# EAGLE design stm32_pi_board (EAGLE 7.4.0)
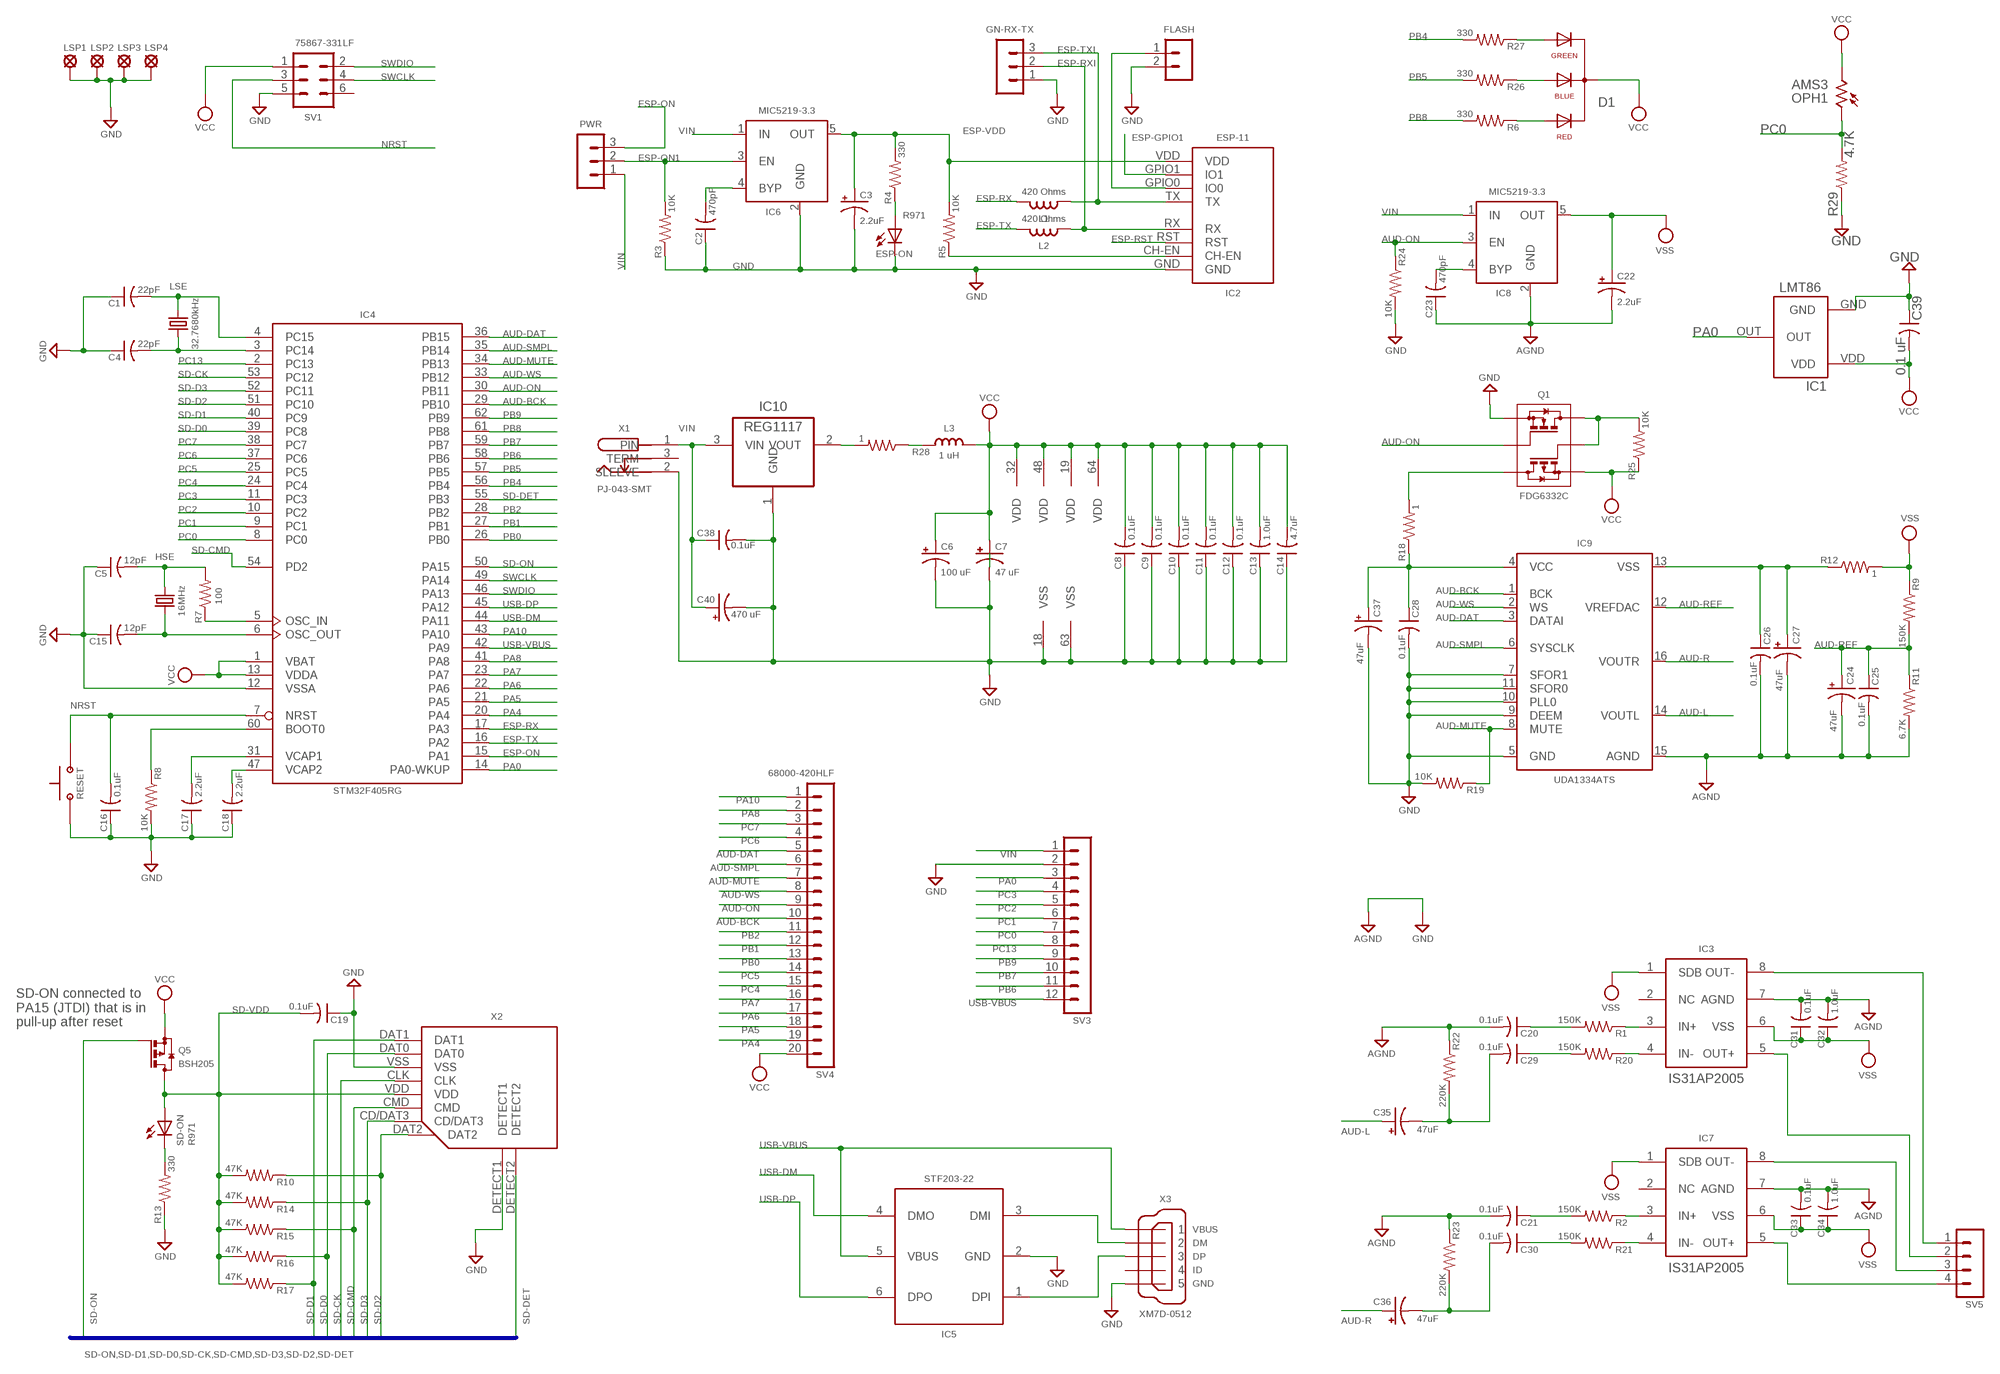
[diagram p0: schematic, sheet 1]

## Parts
C1  22pF  C-US0805  [C0805]
C2  470pF  C-US0805  [C0805]
C3  2.2uF  CPOL-US0805  [CPOL0805]
C4  22pF  C-US0805  [C0805]
C5  12pF  C-US0805  [C0805]
C6  100 uF  CPOL-US1311  [CPOL1311]
C7  47 uF  CPOL-US0805  [CPOL0805]
C8  0.1uF  C-US0805  [C0805]
C9  0.1uF  C-US0805  [C0805]
C10  0.1uF  C-US0805  [C0805]
C11  0.1uF  C-US0805  [C0805]
C12  0.1uF  C-US0805  [C0805]
C13  1.0uF  C-US0805  [C0805]
C14  4.7uF  C-US0805  [C0805]
C15  12pF  C-US0805  [C0805]
C16  0.1uF  C-US0805  [C0805]
C17  2.2uF  C-US0805  [C0805]
C18  2.2uF  C-US0805  [C0805]
C19  0.1uF  C-US0805  [C0805]
C20  0.1uF  C-US0805  [C0805]
C21  0.1uF  C-US0805  [C0805]
C22  2.2uF  CPOL-US0805  [CPOL0805]
C23  470pF  C-US0805  [C0805]
C24  47uF  CPOL-US1311  [CPOL1311]
C25  0.1uF  C-US0805  [C0805]
C26  0.1uF  C-US0805  [C0805]
C27  47uF  CPOL-US1311  [CPOL1311]
C28  0.1uF  C-US0805  [C0805]
C29  0.1uF  C-US0805  [C0805]
C30  0.1uF  C-US0805  [C0805]
C31  0.1uF  C-US0805  [C0805]
C32  1.0uF  C-US0805  [C0805]
C33  0.1uF  C-US0805  [C0805]
C34  1.0uF  C-US0805  [C0805]
C35  47uF  CPOL-US1311  [CPOL1311]
C36  47uF  CPOL-US1311  [CPOL1311]
C37  47uF  CPOL-US1311  [CPOL1311]
C38  0.1uF  C-US0805  [C0805]
C39  0.1 uF  C-US0805  [C0805]
C40  470 uF  CPOL-US2917  [CPOL2917]
D1  RGB-LED3X1MM  [RGB-LED-SMD-3X1]
ESP-ON  R971  LEDCHIP-LED0805  [CHIP-LED0805]
FLASH  MA02-1  [MA02-1]
GN-RX-TX  MA03-1PL  [MA03-1]
HSE  16MHz  Q-HSEHC-46X  [Q-HC-46X]
IC1  LMT86  [LMT86]
IC2  ESP-11  [ESP-11]
IC3  IS31AP2005  [MSOP-8]
IC4  STM32F405RG  STM32F405RGT  [LQFP64]
IC5  STF203-22  [SC70-6]
IC6  MIC5219-3.3  MIC5219XX  [SOT23-5]
IC7  IS31AP2005  [MSOP-8]
IC8  MIC5219-3.3  MIC5219XX  [SOT23-5]
IC9  UDA1334ATS  [SSOP16]
IC10  REG1117  [SOT223]
L1  420 Ohms  L-USL0603  [L0603]
L2  420 Ohms  L-USL0603  [L0603]
L3  1 uH  L-USL0805  [L0805]
LSE  32.7680kHz  Q-LSECM7V-T1A  [Q-CM7V-T1A]
LSP1  LSP27  [LSP27]
LSP2  LSP27  [LSP27]
LSP3  LSP27  [LSP27]
LSP4  LSP27  [LSP27]
OPH1  AMS3  VT935GB  [VT900]
PWR  MA03-1PL  [MA03-1]
Q1  FDG6332C  N-P-MOS  [SC70-6]
Q5  BSH205  BSH205G2R  [SOT23]
R1  150K  R-US0805  [R0805]
R2  150K  R-US0805  [R0805]
R3  10K  R-US0805  [R0805]
R4  330  R-US0805  [R0805]
R5  10K  R-US0805  [R0805]
R6  330  R-US0805  [R0805]
R7  100  R-US0805  [R0805]
R8  10K  R-US0805  [R0805]
R9  150K  R-US0805  [R0805]
R10  47K  R-US0805  [R0805]
R11  6.7K  R-US0805  [R0805]
R12  1  R-US0805  [R0805]
R13  330  R-US0805  [R0805]
R14  47K  R-US0805  [R0805]
R15  47K  R-US0805  [R0805]
R16  47K  R-US0805  [R0805]
R17  47K  R-US0805  [R0805]
R18  1  R-US0805  [R0805]
R19  10K  R-US0805  [R0805]
R20  150K  R-US0805  [R0805]
R21  150K  R-US0805  [R0805]
R22  220K  R-US0805  [R0805]
R23  220K  R-US0805  [R0805]
R24  10K  R-US0805  [R0805]
R25  10K  R-US0805  [R0805]
R26  330  R-US0805  [R0805]
R27  330  R-US0805  [R0805]
R28  1  R-US0805  [R0805]
R29  4.7K  R-US0805  [R0805]
RESET  BUTTON-FSM14JRT  [BUTTON-FSM14JRT]
SD-ON  R971  LEDCHIP-LED0805  [CHIP-LED0805]
SV1  75867-331LF  MA03-2  [MA03-2]
SV3  MA12-1NO-PL  [MA12-1-NO-PL]
SV4  68000-420HLF  MA20-1NO-PL  [MA20-1-NO-PL]
SV5  MA04-1PL  [MA04-1]
X1  PJ-043-SMT  DC-POWER-JACK2  [BUCHSE-1.0X3.2]
X2  DM3AT  MICRO-SD-DM3AT  [DM3AT]
X3  XM7D-0512  MINI-USB-5-DPI  [XM7D-0512]

## Nets
AUD-BCK: IC4.29(PB10) IC9.1(BCK) SV4.10
AUD-DAT: IC4.36(PB15) IC9.3(DATAI) SV4.5
AUD-L: C35.1+(+) IC9.14(VOUTL)
AUD-MUTE: IC4.34(PB13) IC9.8(MUTE) R19.1 SV4.7
AUD-ON: IC4.30(PB11) IC8.3(EN) Q1.2 R24.1 SV4.9
AUD-R: C36.1+(+) IC9.16(VOUTR)
AUD-REF: C24.1+(+) C25.1 IC9.12(VREFDAC) R9.2 R11.1
AUD-SMPL: IC4.35(PB14) IC9.6(SYSCLK) SV4.6
AUD-WS: IC4.33(PB12) IC9.2(WS) SV4.8
BOOT: IC4.60(BOOT0) R8.1
ESP-GPIO1: IC2.GPIO1(IO1)
ESP-IO0: FLASH.1 IC2.GPIO0(IO0)
ESP-ON: IC4.15(PA1) PWR.3
ESP-ON1: IC6.3(EN) PWR.2 R3.2
ESP-RST: IC2.RST
ESP-RX: IC4.17(PA3) L1.2
ESP-RXI: GN-RX-TX.2 IC2.RX L2.1
ESP-TX: IC4.16(PA2) L2.2
ESP-TXI: GN-RX-TX.3 IC2.TX L1.1
ESP-VDD: C3.1+(+) IC2.VDD IC6.5(OUT) R4.2 R5.2
GND: C1.1 C2.1 C3.2-(-) C4.1 C5.1 C6.2-(-) C7.2-(-) C8.1 C9.1 C10.1 C11.1 C12.1 C13.1 C14.1 C15.1 C16.1 C17.1 C18.1 C19.1 C20.2 C21.2 C22.2-(-) C23.1 C24.2-(-) C25.2 C26.2 C27.2-(-) C28.2 C31.2 C32.2 C33.2 C34.2 C37.2-(-) C38.2 C39.1 C40.- ESP-ON.C FLASH.2 GN-RX-TX.1 IC1.GND IC2.GND IC3.7(AGND) IC4.12(VSSA) IC4.18(VSS) IC4.63(VSS) IC5.2(GND) IC6.2(GND) IC7.7(AGND) IC8.2(GND) IC9.5(GND) IC9.7(SFOR1) IC9.9(DEEM) IC9.10(PLL0) IC9.11(SFOR0) IC9.15(AGND) IC10.1(GND) LSP1.MP LSP2.MP LSP3.MP LSP4.MP Q1.1 R3.1 R8.2 R11.2 R13.1 R19.2 R22.1 R23.1 R24.2 R29.1 RESET.P$1 SV1.5 SV3.2 X1.2(SLEEVE) X2.DETECT1 X2.VSS X3.5 ; supply symbol labelled AGND
N$4: C2.2 IC6.4(BYP)
N$5: D1.P$1(AR) R6.1
N$6: IC4.5(OSC_IN) R7.1
N$10: ESP-ON.A R4.1
N$11: IC3.8(OUT-) SV5.1
N$13: IC3.5(OUT+) SV5.2
N$17: C20.1 R1.2
N$22: IC7.8(OUT-) SV5.3
N$24: IC7.5(OUT+) SV5.4
N$26: IC3.3(IN+) R1.1
N$27: IC7.3(IN+) R2.1
N$29: IC5.1(DPI) X3.3
N$36: IC5.3(DMI) X3.2
N$37: C21.1 R2.2
N$38: IC3.4(IN-) R20.1
N$40: D1.P$4(AB) R26.1
N$42: C28.1 C37.1+(+) IC9.4(VCC) R18.1
N$43: IC7.4(IN-) R21.1
N$44: C23.2 IC8.4(BYP)
N$46: C26.1 C27.1+(+) IC9.13(VSS) R12.1
N$47: C30.1 R21.2
N$64: IC2.CH-EN R5.1
N$65: C29.1 R20.2
N$69: C29.2 C35.2-(-) R22.2
N$70: Q1.3 R18.2
N$71: C5.2 HSE.1 R7.2
N$72: C30.2 C36.2-(-) R23.2
N$75: D1.P$3(AG) R27.1
N$78: C15.2 HSE.2 IC4.6(OSC_OUT)
N$85: IC10.2(VOUT) R28.2
N$86: Q1.5 Q1.6 R25.2
N$90: L3.1 R28.1
N$120: R13.2 SD-ON.C
NRST: C16.2 IC4.7(NRST) RESET.P$2 SV1.3
PA0: IC1.OUT IC4.14(PA0-WKUP) SV3.3
PA4: IC4.20(PA4) SV4.19
PA5: IC4.21(PA5) SV4.18
PA6: IC4.22(PA6) SV4.17
PA7: IC4.23(PA7) SV4.16
PA8: IC4.41(PA8) SV4.2
PA10: IC4.43(PA10) SV4.1
PB0: IC4.26(PB0) SV4.13
PB1: IC4.27(PB1) SV4.12
PB2: IC4.28(PB2) SV4.11
PB4: IC4.56(PB4) R27.2
PB5: IC4.57(PB5) R26.2
PB6: IC4.58(PB6) SV3.11
PB7: IC4.59(PB7) SV3.10
PB8: IC4.61(PB8) R6.2
PB9: IC4.62(PB9) SV3.9
PC0: IC4.8(PC0) OPH1.1 R29.2 SV3.7
PC1: IC4.9(PC1) SV3.6
PC2: IC4.10(PC2) SV3.5
PC3: IC4.11(PC3) SV3.4
PC4: IC4.24(PC4) SV4.15
PC5: IC4.25(PC5) SV4.14
PC6: IC4.37(PC6) SV4.4
PC7: IC4.38(PC7) SV4.3
PC13: IC4.2(PC13) SV3.8
Q2M: C4.2 IC4.3(PC14) LSE.1
Q2P: C1.2 IC4.4(PC15) LSE.2
SD-CK: IC4.53(PC12) X2.CLK
SD-CMD: IC4.54(PD2) R15.1 X2.CMD
SD-D0: IC4.39(PC8) R16.1 X2.DAT0
SD-D1: IC4.40(PC9) R17.1 X2.DAT1
SD-D2: IC4.51(PC10) R10.1 X2.DAT2
SD-D3: IC4.52(PC11) R14.1 X2.CD/DAT3
SD-DET: IC4.55(PB3) X2.DETECT2
SD-ON: IC4.50(PA15) Q5.1(G)
SD-VDD: C19.2 Q5.3(D) R10.2 R14.2 R15.2 R16.2 R17.2 SD-ON.A X2.VDD
SWCLK: IC4.49(PA14) SV1.4
SWDIO: IC4.46(PA13) SV1.2
USB-DM: IC4.44(PA11) IC5.4(DMO)
USB-DP: IC4.45(PA12) IC5.6(DPO)
USB-VBUS: IC4.42(PA9) IC5.5(VBUS) SV3.12 X3.1
VCAP3: C18.2 IC4.47(VCAP2)
VCAP4: C17.2 IC4.31(VCAP1)
VDD: C6.1+(+) C7.1+(+) C8.2 C9.2 C10.2 C11.2 C12.2 C13.2 C14.2 C39.2 D1.P$2(C) IC1.VDD IC4.1(VBAT) IC4.13(VDDA) IC4.19(VDD) IC4.32(VDD) IC4.48(VDD) IC4.64(VDD) L3.2 OPH1.2 Q1.4 Q5.2(S) R25.1 SV1.1 SV4.20 ; supply symbol labelled VCC
VIN: C38.1 C40.+ IC6.1(IN) IC8.1(IN) IC10.3(VIN) PWR.1 SV3.1 X1.1(PIN)
VSS: C22.1+(+) C31.1 C32.1 C33.1 C34.1 IC3.1(SDB) IC3.6(VSS) IC7.1(SDB) IC7.6(VSS) IC8.5(OUT) R9.1 R12.2
Unconnected: IC3.2(NC) IC7.2(NC) SV1.6 X1.3(TERM) X3.4 X3.M1(S1) X3.M2(S2) X3.M3(S3) X3.M4(S4)

## Buses
SD-ON,SD-D1,SD-D0,SD-CK,SD-CMD,SD-D3,SD-D2,SD-DET

## Notes on the sheet
- SD-ON connected to 
  PA15 (JTDI) that is in 
  pull-up after reset

## Library data of the parts
C1 C2 C4 C5 C8-C21 C23 C25 C26 C28-C34 C38 C39 = MyComponents:C-US: SMD Multilayer Ceramic Capacitor; MOUSER: 80-C0805C104J5RAUTO
C3 C7 C22 = MyComponents:CPOL-US: SMT Tantalum Capacitor; MOUSER: 581-TAJR225K016RNJ
C6 C24 C27 C35-C37 = MyComponents:CPOL-US: SMT Tantalum Capacitor; MOUSER: 581-F951C476KBAAQ2
C40 = MyComponents:CPOL-US: SMT Tantalum Capacitor; MOUSER: 581-TPSE477K010R0200
D1 = MyComponents:RGB-LED: T-1 3/4 (5mm) full color LED lamp; MOUSER: 604-APFA3010LSEEZGKQ
ESP-ON SD-ON = led:LED: LED OSRAM: - CHIPLED LG R971, LG N971, LY N971, LG Q971, LY Q971, LO R971, LY R971 LH N974, LH R974 LS Q976, LO Q976, LY Q976 LO Q996 - Hyper CHIPLED LW Q18S LB Q993, LB Q99A, LB R99A - SideLED LS A670, LO A670, LY A670, LG A670, LP A670 LB A673, LV A673, LT A673, LW A673 LH A674 LY A675 LS A676, LA A676, LO A676, LY A676, LW A676 LS A679, LY A679, LG A679 - Hyper Micro SIDELED® LS Y876, LA Y876, LO Y876, LY Y876 LT Y87S - SmartLED LW L88C, LW L88S LB L89C, LB L89S, LG L890 LS L89K, LO L89K, LY L89K LS L896, LA L896, LO L896, LY L896 - TOPLED LS T670, LO T670, LY T670, LG T670, LP T670 LSG T670, LSP T670, LSY T670, LOP T670, LYG T670 LG T671, LOG T671, LSG T671 LB T673, LV T673, LT T673, LW T673 LH T674 LS T676, LA T676, LO T676, LY T676, LB T676, LH T676, LSB T676, LW T676 LB T67C, LV T67C, LT T67C, LS T67K, LO T67K, LY T67K, LW E67C LS E67B, LA E67B, LO E67B, LY E67B, LB E67C, LV E67C, LT E67C LW T67C LS T679, LY T679, LG T679 LS T770, LO T770, LY T770, LG T770, LP T770 LB T773, LV T773, LT T773, LW T773 LH T774 LS E675, LA E675, LY E675, LS T675 LS T776, LA T776, LO T776, LY T776, LB T776 LHGB T686 LT T68C, LB T68C - Hyper Mini TOPLED® LB M676 - Mini TOPLED Santana® LG M470 LS M47K, LO M47K, LY M47K Source: http://www.osram.convergy.de LUXEON: - LUMILED® LXK2-PW12-R00, LXK2-PW12-S00, LXK2-PW14-U00, LXK2-PW14-V00 LXK2-PM12-R00, LXK2-PM12-S00, LXK2-PM14-U00 LXK2-PE12-Q00, LXK2-PE12-R00, LXK2-PE12-S00, LXK2-PE14-T00, LXK2-PE14-U00 LXK2-PB12-K00, LXK2-PB12-L00, LXK2-PB12-M00, LXK2-PB14-N00, LXK2-PB14-P00, LXK2-PB14-Q00 LXK2-PR12-L00, LXK2-PR12-M00, LXK2-PR14-Q00, LXK2-PR14-R00 LXK2-PD12-Q00, LXK2-PD12-R00, LXK2-PD12-S00 LXK2-PH12-R00, LXK2-PH12-S00 LXK2-PL12-P00, LXK2-PL12-Q00, LXK2-PL12-R00 Source: www.luxeon.com KINGBRIGHT: KA-3528ASYC Source: www.kingbright.com
FLASH = MyComponents:MA02-1: Headers & Wire Housing, 1 Row, 3 Position
GN-RX-TX PWR = MyComponents:MA03-1: Headers & Wire Housing, 1 Row, 3 Position
HSE = MyComponents:Q-HSE: HSE SMD Crystal; MOUSER: 520-160-20-46X
IC1 = MyComponents:LMT86: Analog Temperature Sensors withClass-AB Output; MOUSER: 95-LMT86LP
IC2 = MyComponents:ESP-11: ESP8266 WiFi Module ESP-11
IC3 IC7 = MyComponents:IS31AP2005: Class-D mono audio power amplifier (2.95W); MOUSER: 870-31AP2005SLS2TR
IC4 = stm32:STM32F405R*T: ARM 32-bit Cortex™-M3 CPU 168 MHz maximum frequency 1024 Kbytes of Flash memory 192 kbytes of SRAM 51 GPIOs 1.8 to 3.6 V application supply; MOUSER: 511-STM32F405RGT6
IC5 = MyComponents:STF203: USB EMI filtering and ESD protection; MOUSER: 947-STF203-22.TCT
IC6 IC8 = MyComponents:MIC5219XX: 500mA-Peak Output LDO Regulator; MOUSER: 998-MIC5219-3.3YM5TR
IC9 = MyComponents:UDA1334ATS: Low power audio DAC with PLL; MOUSER: 771-UDA1334ATSDH-T
IC10 = MyComponents:REG1117: 800mA and 1A Low Dropout (LDO) Positive Regulator 1.8V, 2.5V, 2.85V, 3.3V, 5V, and Adj; MOUSER: 511-LD1117S33
L1 L2 = MyComponents:L-US: SMD Ferrite Bead; MOUSER: 81-BLM11B421S
L3 = MyComponents:L-US: SMD Ferrite Bead; MOUSER: 963-CKP2012N1R0M-T
LSE = MyComponents:Q-LSE: 32.768 kHz SMD Crystal; MOUSER: 428-201562-MG01
LSP1-LSP4 = MyComponents:LSP27: Solder Pad, drill 2.75 mm
OPH1 = photo-elements:VT9: Photoconductive Cell VT900 Series Source: http://optoelectronics.perkinelmer.com/content/Datasheets/DTS_vt900seriesdatasheet.pdf
Q1 = MyComponents:N-P-MOS: The N & P-Channel MOSFET; MOUSER: 512-FDG6332C_F085
Q5 = MyComponents:BSH205G2R: P-channel enhancement mode MOSFET (-2.3A); MOUSER: 771-BSH205G2R
R1-R29 = MyComponents:R-US: SMD Resistor; MOUSER: 660-RK73H2ATTDD1R00F
RESET = MyComponents:BUTTON-FSM14JRT: TE Connectivity / Alcoswitch Round Switch; MOUSER: 506-1571010-1
SV1 = MyComponents:MA03-2: Headers & Wire Housing, 2 Row, 6 Position; MOUSER: 649-75867-331LF
SV3 = MyComponents:MA12-1: Headers & Wire Housing, 1 Row, 12 Position
SV4 = MyComponents:MA20-1: Headers & Wire Housing, 1 Row, 20 Position; MOUSER: 649-68000-420HLF
SV5 = MyComponents:MA04-1: Headers & Wire Housing, 1 Row, 4 Position
X1 = MyComponents:DC-POWER-JACK: DC Power Connector 1 mm X 3.2 mm; MOUSER: 490-PJ-043-SMT-TR
X2 = MyComponents:MICRO-SD-DM3AT: DM3 Series microSD Card Connectors; MOUSER: 798-DM3ATSFPEJM511
X3 = MyComponents:MINI-USB-5-DPI: Mini USB Type B Connector; MOUSER: 653-XM7D-0512

## Board
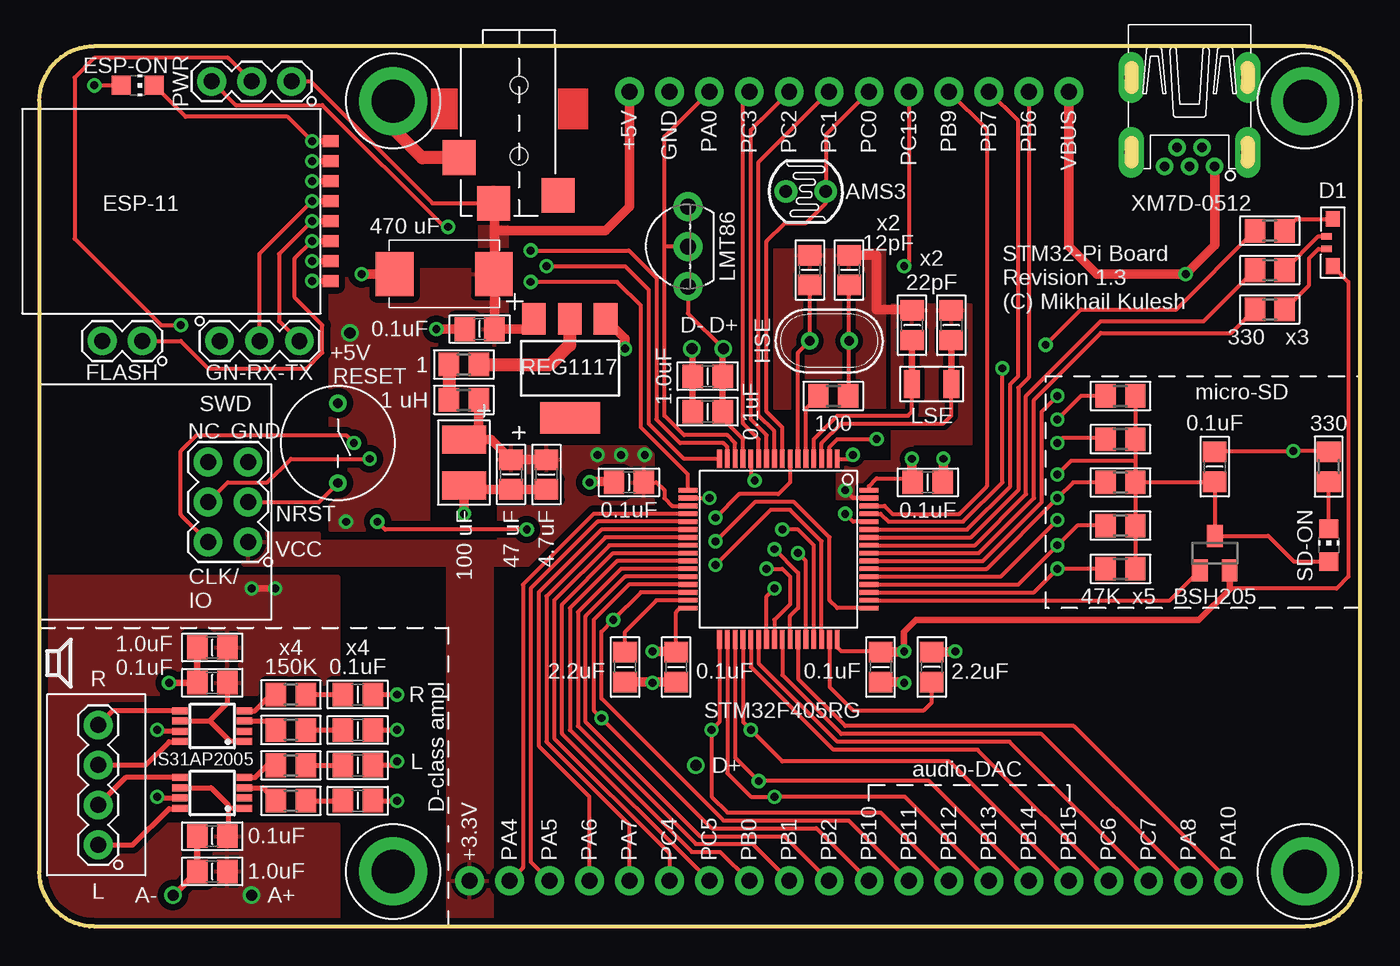
[diagram p1: board, top side]
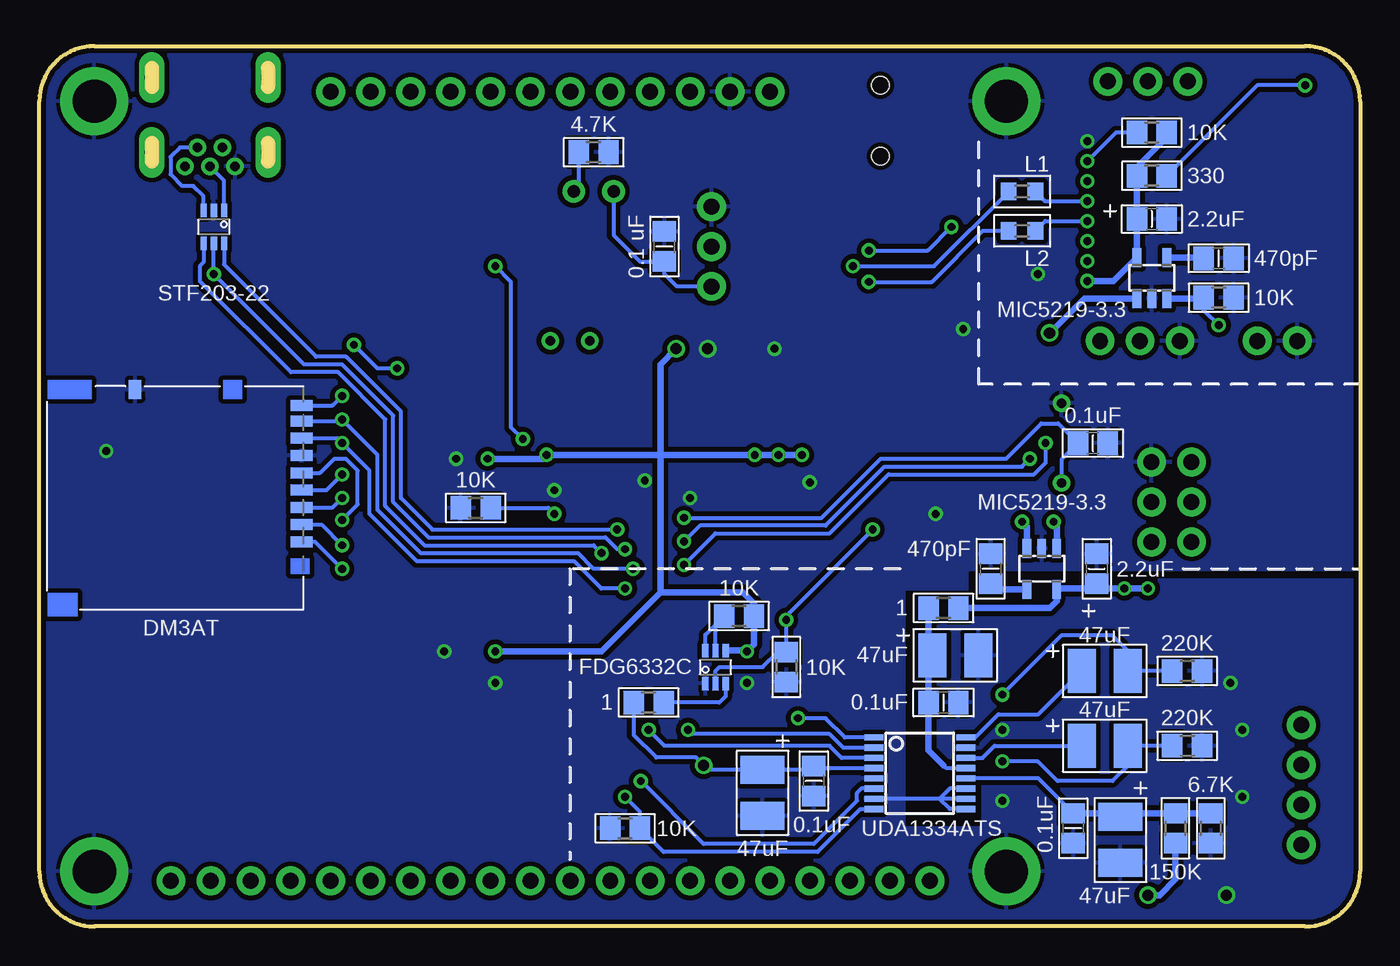
[diagram p2: board, bottom side, seen from below]

Size 84 x 56 mm. Coordinates in mm from the lower left corner, seen from the top.
Outline: 84,3.5 84,52.5 arc90 80.5,56 3.5,56 arc90 0,52.5 0,3.5 arc90 3.5,0 80.5,0 arc90 84,3.5
Copper layers (1*16): Top 0.035mm / dielectric 1.5mm / Bottom 0.035mm
Design rules "eagle *": minimum track width 10mil, minimum drill 19mil, track to track 8mil, track to pad 8mil, pad to pad 7mil, via to via 12mil, smd to smd 7mil, copper to edge 10mil, drill to drill 30mil, minimum pad ring 10mil, minimum via ring 8mil, stop-mask expansion 4mil, vias tented up to drill 0mil, thermal gap 10mil

### Footprints (pad centres in the part's own frame; a part is rotated, then mirrored left to right if it is on the bottom)
C0805 = smd 1.3 x 1.5: 1 -0.95,0; 2 0.95,0
CPOL0805 = smd 1.3 x 1.5: 1+ -0.95,0; 2- 0.95,0
CPOL1311 = smd 1.778 x 2.794: 1+ -1.462,0; 2- 1.462,0
CPOL2917 = smd 2.4 x 2.8: + -3.15,0; - 3.15,0
RGB-LED-SMD-3X1 = smd 1 x 0.9: P$1 1.5,0; P$2 -1.5,0 | smd 0.4 x 0.68: P$3 -0.4,0.4; P$4 0.4,0.4
CHIP-LED0805 = smd 1.2 x 1.2: A 0,-1.05; C 0,1.05
MA02-1 = drill 1.016: 1 -2.54,0; 2 0,0
MA03-1 = drill 1.016: 1 -2.54,0; 2 0,0; 3 2.54,0
Q-HC-46X = drill 0.61: 1 -1.25,0; 2 1.25,0
LMT86 = drill 1.016: GND 2.54,0; OUT 0,0; VDD -2.54,0
ESP-11 = smd 1.016 x 0.762: CH-EN 9.525,3.175; GND 9.525,4.445; GPIO0 9.525,-1.905; GPIO1 9.525,-3.175; RST 9.525,1.905; RX 9.525,0.635; TX 9.525,-0.635; VDD 9.525,-4.445
MSOP-8 = smd 0.45 x 1: 1 -0.975,-2.05; 2 -0.325,-2.05; 3 0.325,-2.05; 4 0.975,-2.05; 5 0.975,2.05; 6 0.325,2.05; 7 -0.325,2.05; 8 -0.975,2.05
LQFP64 = smd 0.3 x 1.2: 1 -3.75,-5.75; 2 -3.25,-5.75; 3 -2.75,-5.75; 4 -2.25,-5.75; 5 -1.75,-5.75; 6 -1.25,-5.75; 7 -0.75,-5.75; 8 -0.25,-5.75; 9 0.25,-5.75; 10 0.75,-5.75; 11 1.25,-5.75; 12 1.75,-5.75; 13 2.25,-5.75; 14 2.75,-5.75; 15 3.25,-5.75; 16 3.75,-5.75; 33 3.75,5.75; 34 3.25,5.75; 35 2.75,5.75; 36 2.25,5.75; 37 1.75,5.75; 38 1.25,5.75; 39 0.75,5.75; 40 0.25,5.75; 41 -0.25,5.75; 42 -0.75,5.75; 43 -1.25,5.75; 44 -1.75,5.75; 45 -2.25,5.75; 46 -2.75,5.75; 47 -3.25,5.75; 48 -3.75,5.75 | smd 1.2 x 0.3: 17 5.75,-3.75; 18 5.75,-3.25; 19 5.75,-2.75; 20 5.75,-2.25; 21 5.75,-1.75; 22 5.75,-1.25; 23 5.75,-0.75; 24 5.75,-0.25; 25 5.75,0.25; 26 5.75,0.75; 27 5.75,1.25; 28 5.75,1.75; 29 5.75,2.25; 30 5.75,2.75; 31 5.75,3.25; 32 5.75,3.75; 49 -5.75,3.75; 50 -5.75,3.25; 51 -5.75,2.75; 52 -5.75,2.25; 53 -5.75,1.75; 54 -5.75,1.25; 55 -5.75,0.75; 56 -5.75,0.25; 57 -5.75,-0.25; 58 -5.75,-0.75; 59 -5.75,-1.25; 60 -5.75,-1.75; 61 -5.75,-2.25; 62 -5.75,-2.75; 63 -5.75,-3.25; 64 -5.75,-3.75
SC70-6 = smd 0.4 x 0.85: 1 -0.65,-1.05; 2 0,-1.05; 3 0.65,-1.05; 4 0.65,1.05; 5 0,1.05; 6 -0.65,1.05
SOT23-5 = smd 0.55 x 1.2: 1 -0.95,-1.3; 2 0,-1.3; 3 0.95,-1.3; 4 0.95,1.3; 5 -0.95,1.3
SSOP16 = smd 0.4 x 1.2: 1 -2.275,-2.925; 2 -1.625,-2.925; 3 -0.975,-2.925; 4 -0.325,-2.925; 5 0.325,-2.925; 6 0.975,-2.925; 7 1.625,-2.925; 8 2.275,-2.925; 9 2.275,2.925; 10 1.625,2.925; 11 0.975,2.925; 12 0.325,2.925; 13 -0.325,2.925; 14 -0.975,2.925; 15 -1.625,2.925; 16 -2.275,2.925
SOT223 = smd 1.499 x 2.007: 1 -2.261,-3.15; 2 0.025,-3.15; 3 2.311,-3.15 | smd 3.81 x 2.007: 4 0,3.15
L0603 = smd 1 x 1.1: 1 -0.85,0; 2 0.85,0
L0805 = smd 1.3 x 1.5: 1 -0.95,0; 2 0.95,0
Q-CM7V-T1A = smd 1 x 1.8: 1 -1.25,0; 2 1.25,0
LSP27 = drill 2.75 pad 4.318: MP 0,0
VT900 = drill 0.8 pad 1.4: 1 -1.27,0; 2 1.27,0
SOT23 = smd 1 x 1.4: 1 -0.95,-1.1; 2 0.95,-1.1; 3 0,1.1
R0805 = smd 1.3 x 1.5: 1 -0.95,0; 2 0.95,0
BUTTON-FSM14JRT = drill 0.6: P$1 -2.54,0; P$2 2.54,0
MA03-2 = drill 1.016: 1 -2.54,-1.27; 2 -2.54,1.27; 3 0,-1.27; 4 0,1.27; 5 2.54,-1.27; 6 2.54,1.27
MA12-1-NO-PL = drill 1.016: 1 -13.97,0; 2 -11.43,0; 3 -8.89,0; 4 -6.35,0; 5 -3.81,0; 6 -1.27,0; 7 1.27,0; 8 3.81,0; 9 6.35,0; 10 8.89,0; 11 11.43,0; 12 13.97,0
MA20-1-NO-PL = drill 1.016: 1 -24.13,0; 2 -21.59,0; 3 -19.05,0; 4 -16.51,0; 5 -13.97,0; 6 -11.43,0; 7 -8.89,0; 8 -6.35,0; 9 -3.81,0; 10 -1.27,0; 11 1.27,0; 12 3.81,0; 13 6.35,0; 14 8.89,0; 15 11.43,0; 16 13.97,0; 17 16.51,0; 18 19.05,0; 19 21.59,0; 20 24.13,0
MA04-1 = drill 1.016: 1 -3.81,0; 2 -1.27,0; 3 1.27,0; 4 3.81,0
BUCHSE-1.0X3.2 = smd 2.2 x 2.1: 1 10,-1.6; 2 7.1,-3.8; 3 9.5,2.5 | hole 1.1: 7,0; 2.5,0
DM3AT = smd 0.7 x 1.4: CD/DAT3 1.44,7.685; CLK -1.86,7.685; CMD 0.34,7.685; DAT0 -4.06,7.685; DAT1 -5.16,7.685; DAT2 2.54,7.685; DETECT2 -6.15,7.685; VDD -0.76,7.685; VSS -2.96,7.685 | smd 1.2 x 0.8: DETECT1 -7.16,-2.915
XM7D-0512 = drill 0.6 pad 1.016: 1 1.6,-0.9; 2 0.8,0.3; 3 0,-0.9; 4 -0.8,0.3; 5 -1.6,-0.9 | drill 0.9 pad 1.422 long: M1 3.7,4.75; M2 -3.7,4.75; M3 -3.7,0; M4 3.7,0

### Placement (x,y rotation side)
C1  55.5,38.25 270 top
C2  9,42.5 180 bottom
C3  13.25,45 0 bottom
C4  58,38.25 270 top
C5  51.5,41.75 270 top
C6  27,29.5 270 top
C7  30,28.75 270 top
C8  53.5,16.5 90 top
C9  40.5,16.5 90 top
C10  42.5,32.75 0 top
C11  37.5,28.25 0 top
C12  56.5,28.25 180 top
C13  42.5,35 0 top
C14  32.25,28.75 90 top
C15  49,41.75 270 top
C16  17,30.75 180 bottom
C17  37.25,16.5 90 top
C18  56.75,16.5 270 top
C19  74.75,29.25 270 top
C20  20.25,8 0 top
C21  20.25,12.5 0 top
C22  16.75,22.75 90 bottom
C23  23.5,22.75 270 bottom
C24  15.25,5.5 270 bottom
C25  18.25,6.25 270 bottom
C26  26.5,14.25 0 bottom
C27  25.75,17.25 0 bottom
C28  34.75,9.25 270 bottom
C29  20.25,10.25 0 top
C30  20.25,14.75 0 top
C31  11,5.75 180 top
C32  11,3.5 180 top
C33  11,15.5 180 top
C34  11,17.75 180 top
C35  16.25,11.5 0 bottom
C36  16.25,16.25 0 bottom
C37  38,8.5 270 bottom
C38  28,38 180 top
C39  44.25,43.25 270 bottom
C40  25.75,41.5 180 top
D1  82.25,43.5 90 top
ESP-ON  6.25,53.5 270 top
FLASH  4,37.25 180 top
GN-RX-TX  14,37.25 0 top
HSE  50.25,37.25 180 top
IC1  41.25,43.25 90 top
IC2  9,45.5 0 top
IC3  11,8.5 90 top
IC4  47,24 180 top
IC5  72.9,44.5 180 bottom
IC6  13.25,41.25 0 bottom
IC7  11,12.75 90 top
IC8  20.25,22.75 180 bottom
IC9  28,9.75 270 bottom
IC10  33.75,35.5 180 top
L1  21.5,44.25 180 bottom
L2  21.5,46.75 180 bottom
L3  27,33.5 0 top
LSE  56.75,34.5 180 top
LSP1  80.5,3.5 90 top
LSP2  80.5,52.5 90 top
LSP3  22.5,3.5 90 top
LSP4  22.5,52.5 90 top
OPH1  48.75,46.75 180 top
PWR  13.5,53.75 180 top
Q1  41,16.5 0 bottom
Q5  74.75,23.75 0 top
R1  16,8 0 top
R2  16,12.5 0 top
R3  9,40 180 bottom
R4  13.25,47.75 180 bottom
R5  13.25,50.5 0 bottom
R6  78.25,44.25 180 top
R7  50.5,33.75 0 top
R8  56.25,26.62 180 bottom
R9  11.75,6.25 90 bottom
R10  68.75,22.75 0 top
R11  9.5,6.25 270 bottom
R12  26.5,20.25 0 bottom
R13  82,29.25 270 top
R14  68.75,25.5 0 top
R15  68.75,28.25 0 top
R16  68.75,31 0 top
R17  68.75,33.75 0 top
R18  45.25,14.25 0 bottom
R19  46.75,6.25 180 bottom
R20  16,10.25 0 top
R21  16,14.75 0 top
R22  11,11.5 180 bottom
R23  11,16.25 180 bottom
R24  36.5,16.5 270 bottom
R25  39.5,19.75 180 bottom
R26  78.25,41.75 180 top
R27  78.25,39.25 180 top
R28  27,35.75 0 top
R29  48.75,49.25 180 bottom
RESET  19,30.75 270 top
SD-ON  82,24.25 0 top
SV1  12,27 90 top
SV3  51.5,53.1 0 top
SV4  51.5,2.9 180 top
SV5  3.75,9 90 top
X1  30.5,56 270 top
X2  75,27 270 bottom
X3  73.15,49.25 0 top

### Tracks (layer width: path | path; a pad name or v marks a point on that pad's centre or on a via)
AUD-BCK  (via drill 0.5)
  Top 0.254: IC4.29 37.5,21.75 35.25,19.5 35.25,13.75 v35.75,13.25 42.75,6.25 49.42,6.25 SV4.10
  Bottom 0.254: IC9.1 32.77,12.03 34,13.25 v35.75,13.25
AUD-DAT  (via drill 0.5)
  Top 0.254: SV4.5 57.87,10.5 47.25,10.5 v45.25,12.5 44.75,13 IC4.36
  Bottom 0.254: IC9.3 32.98,10.72 33.75,11.5 44.25,11.5 v45.25,12.5
AUD-L
  Bottom 0.254: IC9.14 24.02,10.72 23.25,11.5 C35.1+
AUD-MUTE  (via drill 0.5)
  Top 0.254: IC4.34 43.75,9.75 45.25,8.25 v46.75,8.25 55.04,8.25 SV4.7
  Bottom 0.254: IC9.8 30.95,7.45 31.8,7.45 34.5,4.75 44.3,4.75 R19.1 45.8,7.3 v46.75,8.25
AUD-ON  (via drill 0.5)
  Top 0.254: IC4.30 38.25,21.25 v36.5,19.5 35.75,18.75 35.75,14.5 43.5,6.75 51.46,6.75 SV4.9 | v31,25.25 22,25.25 v21.5,25.75
  Bottom 0.254: Q1.2 41,16.25 40.75,16.5 38,16.5 37,17.5 36.55,17.5 R24.1 v36.5,19.5 36.5,19.75 v31,25.25
  Bottom 0.406: IC8.3 21.2,25.45 v21.5,25.75
AUD-R
  Bottom 0.254: IC9.16 24.48,12.03 23,13.5 20.46,13.5 C36.1+
AUD-REF
  Bottom 0.254: C25.1 20.48,9.43 IC9.12
  Bottom 0.406: R11.1 R9.2 15.01,7.2 C24.1+ 15.49,7.2 C25.1
AUD-SMPL  (via drill 0.5)
  Top 0.254: IC4.35 44.25,10.75 v45.75,9.25 56.58,9.25 SV4.6
  Bottom 0.254: IC9.6 31.73,8.78 32,8.5 32,8 34.75,5.25 41.75,5.25 v45.75,9.25
AUD-WS  (via drill 0.5)
  Top 0.254: IC4.33 43.25,13 v42.75,12.5 42.75,8.25 43.75,7.25 53.5,7.25 SV4.8
  Bottom 0.254: IC9.2 32.88,11.38 33.75,12.25 42.5,12.25 v42.75,12.5
BOOT  (via drill 0.5)
  Top 0.254: IC4.60 51.75,25.75 v51.25,26.25
  Bottom 0.254: R8.1 51.62,26.62 v51.25,26.25
ESP-GPIO1  (via drill 0.5)
  Top 0.406: v17.35,42.33 IC2.GPIO1
ESP-IO0  (via drill 0.5)
  Top 0.254: FLASH.1 9,37.25 10.75,35.5 17,35.5 18,36.5 18,38.25 16.25,40 16.25,42.5 v17.35,43.6
  Top 0.406: v17.35,43.6 v17.35,43.59 IC2.GPIO0
ESP-ON  (via drill 0.5)
  Top 0.254: IC4.15 43.75,30.5 43.5,30.75 40.75,30.75 39.25,32.25 39.25,41.25 37.5,43 v31.25,43 | PWR.3 11,53.75 12.5,52.25 18,52.25 25.75,44.5 v26,44.5
  Bottom 0.254: v31.25,43 27.5,43 v26,44.5
ESP-ON1  (via drill 0.5)
  Top 0.254: v9,38.25 7.75,38.25 2.25,43.75 2.25,54 3.5,55.25 12,55.25 PWR.2
  Bottom 0.254: 10,39.95 10,39.25 v9,38.25
  Bottom 0.406: IC6.3 10,39.95 R3.2
ESP-RST  (via drill 0.5)
  Top 0.406: v17.35,47.41 17.38,47.41 IC2.RST
ESP-RX  (via drill 0.5)
  Top 0.254: IC4.17 41.25,28.75 38.25,31.75 38.25,39.5 36.75,41 v31.25,41
  Bottom 0.254: v31.25,41 27.25,41 24,44.25 L1.2
ESP-RXI  (via drill 0.5)
  Top 0.254: GN-RX-TX.2 14,42.79 v17.35,46.14
  Top 0.406: v17.35,46.14 v17.35,46.13 IC2.RX
  Bottom 0.254: L2.1 20.04,46.14 v17.35,46.14
ESP-TX  (via drill 0.5)
  Top 0.254: IC4.16 41,29.75 38.75,32 38.75,40.5 37.25,42 v32.25,42
  Bottom 0.254: v32.25,42 27.1,42 L2.2
ESP-TXI  (via drill 0.5)
  Top 0.254: v17.35,44.87 15.25,42.77 15.25,38.5 16.5,37.25 GN-RX-TX.3
  Top 0.406: v17.35,44.87 IC2.TX
  Bottom 0.254: L1.1 20.03,44.87 v17.35,44.87
ESP-VDD  (via drill 0.5)
  Top 0.406: IC2.VDD v17.35,41.05 v17.35,41.06
  Bottom 0.406: 17.35,41 v17.35,41.06 15.69,41.06 IC6.5 C3.1+ R4.2 14,47.95 14,48.5 12.3,50.2 R5.2
GND  (via drill 0.5, 0.7)
  Top 0.254: 17.3,50 v17.35,49.95 15.8,51.5 9.3,51.5 ESP-ON.C | R13.1 81.95,30.25 v79.75,30.25 74.8,30.25 C19.1 | IC4.18 v42.62,27.25 | IC4.12 45.25,28.62 v45.5,28.38 | IC4.63 51.75,27.25 v51.25,27.75
  Top 0.305: v7.5,8.25 7.58,8.18 IC3.7 | IC7.7 7.58,12.43 v7.5,12.5 | C21.2 v22.75,12.5 | C20.2 v22.75,8
  Top 0.406: v17.35,49.95 IC2.GND | C34.2 C33.2 v8.25,15.5 | 55,15.55 v55,15.5 | v8.5,2 8.55,2 C32.2 C31.2 | C10.1 C13.1 41.55,36.7 v41.5,36.75
  Top 0.61: 40.45,15.5 C9.1 39,15.55 | 55,15.55 C8.1 | C18.1 58.2,17.45 v58.25,17.5 | 37.3,15.5 C17.1 39,15.55 | 39,15.55 v39,15.5 | C11.1 36.5,28.3 35.05,28.3 v35,28.25 | v57.5,29.75 57.5,28.3 C12.1 | C5.1 53.25,42.7 53.25,39.25 55.5,39.25 C1.1 | C38.2 v25.25,38 | C14.1 C7.2- 27,27.8 C6.2- v27,26.25 | C40.- v20.5,41.5 | IC10.1 37.25,37.41 v37.25,36.75
  Top 0.813: X1.2 24.35,48.9 22.5,50.75 LSP4.MP
  Bottom 0.254: IC9.10 26.75,8.12 | 26.75,8.12 IC9.7 | IC9.9 26.1,7.47 26.75,8.12 | IC9.11 26.1,8.78 26.75,8.12
  pour Bottom (isolate 0.305, rank 2): 0,56 84,56 84,0 22.5,0 22.5,6.25 29,6.25 29,21.5 25,21.5 25,22.75 0,22.75
  pour Bottom (isolate 0.305, rank 2): 0,22 28,22 28,9.5 24,9.5 24,0 0,0
  pour Top (isolate 0.305): 54.25,39.5 54.25,29.5 50.75,29.5 50.75,27.25 52.75,27.25 52.75,28.5 55.5,28.5 55.5,30.75 59.25,30.75 59.25,39.5
  pour Top (isolate 0.305): 46.75,43 46.75,33 53.75,33 53.75,43
N$4
  Bottom 0.406: IC6.4 10,42.55 C2.2
N$5
  Top 0.254: R6.1 79.95,45 D1.P$1
N$6
  Top 0.254: IC4.5 48.75,32.95 R7.1
N$10  (via drill 0.5)
  Top 0.254: v3.5,53.5 ESP-ON.A
  Bottom 0.254: v3.5,53.5 6.55,53.5 R4.1
N$11
  Top 0.305: SV5.1 5.94,5.19 8.25,7.5 8.93,7.5 IC3.8
N$13
  Top 0.305: IC3.5 5.5,9.47 SV5.2
N$17
  Top 0.305: R1.2 C20.1
N$22
  Top 0.305: SV5.3 6.77,10.27 8.25,11.75 8.93,11.75 arc90 IC7.8
N$24
  Top 0.305: IC7.5 4.67,13.72 SV5.4
N$26
  Top 0.305: IC3.3 14.22,8.82 R1.1
N$27
  Top 0.305: IC7.3 14.47,13.07 R2.1
N$29
  Bottom 0.254: IC5.1 72.25,47.45 X3.3
N$36
  Bottom 0.254: X3.2 75.05,49.55 75.65,48.95 75.65,47.85 74.9,47.1 74.2,47.1 73.55,46.45 IC5.3
N$37
  Top 0.305: R2.2 C21.1
N$38
  Top 0.305: IC3.4 13.72,9.47 14.5,10.25 R20.1
N$40
  Top 0.254: R26.1 81.35,43.9 D1.P$4
N$42  (via drill 0.7)
  Bottom 0.254: 37.99,9.95 C37.1+ | R18.1 46.2,12.2 44.75,10.75 42.25,10.75 v41.75,10.25 41.46,9.96 C37.1+ | IC9.4 34.62,10.07 C28.1 arc90 34.99,9.96 C37.1+
N$43
  Top 0.305: IC7.4 13.72,13.72 14.75,14.75 R21.1
N$44
  Bottom 0.254: 23.15,21.45 C23.2
  Bottom 0.406: IC8.4 23.15,21.45
N$46
  Bottom 0.254: IC9.13 26.32,10.07 26.5,10.25
  Bottom 0.406: R12.1 27.45,17.25 | 27.45,17.25 C26.1 27.45,11.2 26.5,10.25 | C27.1+ 27.45,17.25
N$47
  Top 0.305: R21.2 C30.1
N$64  (via drill 0.5)
  Top 0.406: v17.35,48.68 v17.35,48.67 IC2.CH-EN
  Bottom 0.254: v17.35,48.67 v17.35,48.68 15.53,50.5 R5.1
N$65
  Top 0.305: R20.2 C29.1
N$69  (via drill 0.5)
  Top 0.305: 21.45,10.5 C29.2 22.5,10.25 v22.75,10.5
  Bottom 0.254: R22.2 C35.2- 14.79,10.21 15.75,9.25 19.25,9.25 20.5,10.5 v22.75,10.5
N$70
  Bottom 0.254: Q1.3 40.35,14.65 40.75,14.25 R18.2
N$71
  Top 0.254: C5.2 HSE.1 51.5,33.8 R7.2
N$72  (via drill 0.5)
  Top 0.305: C30.2 v22.75,14.75
  Bottom 0.254: R23.2 C36.2- 14.79,17.54 15.75,18.5 19,18.5 v22.75,14.75
N$75
  Top 0.254: R27.1 80.75,40.8 80.75,42.5 81.35,43.1 D1.P$3
N$78
  Top 0.254: C15.2 HSE.2 48.25,36.5 IC4.6
N$85
  Top 0.813: IC10.2 33.73,36.98 32.5,35.75 R28.2
N$86
  Bottom 0.254: Q1.5 41,19.2 R25.2 41.65,18.55 Q1.6
N$90
  Top 0.813: R28.1 L3.1
N$120
  Top 0.254: SD-ON.C R13.2
NRST  (via drill 0.5)
  Top 0.254: IC4.7 47.75,28.25 47,27.5 44.5,27.5 v43,26 | SV1.3 17.79,27 RESET.P$2
  Bottom 0.254: v43,26 34.25,26 30.5,29.75 22.54,29.75 20.29,32 19.2,32 C16.2 19,29.7 RESET.P$2
PA0
  Top 0.254: IC4.14 44.25,30.75 43.75,31.25 41,31.25 39.75,32.5 39.75,43.25 | SV3.3 39.75,50.24 39.75,43.25 | IC1.OUT 39.75,43.25
PA4
  Top 0.254: IC4.20 35.25,26.25 30.75,21.75 30.75,3.74 SV4.19
PA5
  Top 0.254: IC4.21 35.5,25.75 31.25,21.5 31.25,4.1 SV4.18
PA6
  Top 0.254: IC4.22 35.75,25.25 31.75,21.25 31.75,11.5 34.99,8.26 SV4.17
PA7
  Top 0.254: IC4.23 36,24.75 32.25,21 32.25,11.75 37.53,6.47 SV4.16
PA8
  Top 0.254: IC4.41 47.25,16 51,12.25 63.74,12.25 SV4.2
PA10
  Top 0.254: IC4.43 48.25,15.75 51.25,12.75 65.78,12.75 SV4.1
PB0
  Top 0.254: IC4.26 36.75,23.25 33.75,20.25 33.75,12.5 41.5,4.75 43.3,4.75 SV4.13
PB1
  Top 0.254: IC4.27 37,22.75 34.25,20 34.25,12.75 41.75,5.25 45.34,5.25 SV4.12
PB2
  Top 0.254: IC4.28 37.25,22.25 34.75,19.75 34.75,13 42,5.75 47.38,5.75 SV4.11
PB4
  Top 0.254: IC4.56 59.75,23.75 63.25,27.25 63.25,33.5 67.5,37.75 75.8,37.75 R27.2
PB5
  Top 0.254: IC4.57 59.5,24.25 62.75,27.5 62.75,33.75 67.5,38.5 74.05,38.5 R26.2
PB6
  Top 0.254: IC4.58 59.25,24.75 62.25,27.75 62.25,34.25 62.93,34.93 SV3.11
PB7
  Top 0.254: IC4.59 59,25.25 61.75,28 61.75,34.5 62.25,35 62.25,51.24 SV3.10
PB8  (via drill 0.5)
  Top 0.254: R6.2 72.3,39.25 66.25,39.25 v64,37 | IC4.61 53.5,26.25 54,25.75 58.75,25.75 61.25,28.25 v61.25,35.5
  Bottom 0.254: v61.25,35.5 62.5,35.5 v64,37
PB9
  Top 0.254: SV3.9 60.25,50.7 60.25,28 58.5,26.25 54.25,26.25 53.75,26.75 IC4.62
PC0
  Top 0.254: IC4.8 47.25,31.75 46.25,32.75 46.25,43.58 47.42,44.75 48.75,44.75 50.02,46.02 OPH1.1 50.02,50.35 SV3.7
  Bottom 0.254: R29.2 49.7,47.07 OPH1.1
PC1
  Top 0.254: SV3.6 45.75,48.62 45.75,32.5 46.75,31.5 IC4.9
PC2
  Top 0.254: SV3.5 45.92,51.33 45.75,51.16 45.25,50.66 45.25,32.25 46.25,31.25 IC4.10
PC3
  Top 0.254: IC4.11 45.75,31 44.75,32 44.75,52.7 SV3.4
PC4
  Top 0.254: IC4.24 36.25,24.25 32.75,20.75 32.75,11.97 40.07,4.65 SV4.15
PC5
  Top 0.254: SV4.14 33.25,12.26 33.25,20.5 36.5,23.75 IC4.25
PC6
  Top 0.254: IC4.37 45.25,16.5 50.5,11.25 59.66,11.25 SV4.4
PC7
  Top 0.254: IC4.38 45.75,16.75 50.75,11.75 61.7,11.75 SV4.3
PC13  (via drill 0.5)
  Top 0.254: IC4.2 50.25,30.5 50.75,31 v53.25,31 | SV3.8 55.31,42.31 v55,42
  Bottom 0.254: v53.25,31 54,31.75 54,41 v55,42
Q2M
  Top 0.254: IC4.3 49.75,30.75 51,32 57.5,32 58,32.5 LSE.1 58.25,34.5
  Top 0.406: LSE.1 C4.2
Q2P
  Top 0.254: IC4.4 49.25,31 50.75,32.5 55.25,32.5 55.5,32.75 LSE.2
  Top 0.406: LSE.2 C1.2
SD-CK  (via drill 0.5)
  Top 0.254: IC4.53 61.15,22.25 v64.75,25.85
  Bottom 0.254: X2.CLK 66.15,28.85 65.25,29.75 64.5,29.75 63.75,29 63.75,26.85 v64.75,25.85
SD-CMD  (via drill 0.5)
  Top 0.254: IC4.54 60.25,22.75 v64.75,27.25 65.75,28.25 R15.1
  Bottom 0.254: X2.CMD 65.34,26.66 v64.75,27.25
SD-D0  (via drill 0.5)
  Top 0.254: R16.1 67.74,31.06 65.06,31.06 v64.75,30.75 | IC4.39 46.25,21 v46.75,21.5
  Bottom 0.254: X2.DAT0 65.06,31.06 v64.75,30.75 63,29 63,26.25 60,23.25 50,23.25 48.25,21.5 v46.75,21.5
SD-D1  (via drill 0.5)
  Top 0.254: R17.1 66.25,33.75 v64.75,32.25 | v46.25,22.75 47.25,22.75 47.75,22.25 47.75,20.5 46.75,19.5 IC4.40
  Bottom 0.254: X2.DAT1 64.84,32.16 v64.75,32.25 62.5,30 62.5,26.5 59.75,23.75 49.75,23.75 48.75,22.75 v46.25,22.75
SD-D2  (via drill 0.5)
  Top 0.254: IC4.51 63.25,21.25 v64.75,22.75 R10.1
  Bottom 0.254: v64.75,22.75 66.46,24.46 X2.DAT2
SD-D3  (via drill 0.5)
  Top 0.254: IC4.52 62.25,21.75 v64.75,24.25 66,25.5 R14.1
  Bottom 0.254: X2.CD/DAT3 66.06,25.56 v64.75,24.25
SD-DET  (via drill 0.5)
  Top 0.254: IC4.55 60,23.25 63.75,27 63.75,32.75 v64.75,33.75
  Bottom 0.254: X2.DETECT2 65.35,33.15 v64.75,33.75
SD-ON
  Top 0.254: IC4.50 71.9,20.75 Q5.1
SD-VDD  (via drill 0.5)
  Top 0.254: R17.2 R16.2 69.7,29.62 | 69.7,29.62 R15.2 | R15.2 R14.2 R10.2 69.75,22.7 | R15.2 69.75,28.2 69.8,28.25 | R15.2 74.7,28.25 C19.2 Q5.3 78.15,24.85 79.8,23.2 SD-ON.A | 69.7,29.62 65.62,29.62 v64.75,28.75
  Bottom 0.254: X2.VDD 65.74,27.76 v64.75,28.75
SWCLK  (via drill 0.5)
  Top 0.254: IC4.49 50.75,20.25 50.25,20.75 50.25,24.75 48,27 45.5,27 v43,24.5 | SV1.4 11.98,28.25 14.5,28.25 16,29.75 v21,29.75
  Bottom 0.254: v43,24.5 42,25.5 34,25.5 30.25,29.25 21.5,29.25 v21,29.75
SWDIO  (via drill 0.5)
  Top 0.254: IC4.46 49.75,24.5 47.75,26.5 46.5,26.5 v43,23 | SV1.2 9,26.19 9,30.25 10,31.25 19.5,31.25 v20,30.75
  Bottom 0.254: v20,30.75 20,29.5 20.75,28.75 30,28.75 33.75,25 41,25 v43,23
USB-DM  (via drill 0.5)
  Top 0.254: IC4.44 48.75,23.25 v48.25,23.75
  Bottom 0.254: IC5.4 73.55,42.25 73.8,42 73.8,41.05 68,35.25 65,35.25 62,32.25 62,26.75 59.5,24.25 48.75,24.25 v48.25,23.75
USB-DP  (via drill 0.5)
  Top 0.254: IC4.45 49.25,24.25 48.25,25.25 v47.25,25.25
  Bottom 0.254: IC5.6 72.25,42.1 66.4,36.25 64.5,36.25 61,32.75 61,27.25 59,25.25 v47.25,25.25
USB-VBUS  (via drill 0.5)
  Top 0.254: v46.75,24 48.25,22.5 48.25,20.25 47.75,19.75 IC4.42
  Top 0.61: X3.1 74.75,43.35 v72.9,41.5 67.25,41.5 65.47,43.28 SV3.12
  Bottom 0.254: IC5.5 v72.9,41.5 67.15,35.75 64.75,35.75 61.5,32.5 61.5,27 59.25,24.75 48,24.75 47.25,24 v46.75,24
VCAP3
  Top 0.254: IC4.47 50.25,15.25 51.75,13.75 56.25,13.75 56.75,14.25 C18.2
VCAP4
  Top 0.254: C17.2 37.25,18.75 39.25,20.75 IC4.31
VDD  (via drill 0.5, 0.7)
  Top 0.254: C9.2 40.5,20 40.75,20.25 IC4.32 | C8.2 53.45,17.5 51,17.5 50.75,17.75 IC4.48 | IC4.64 52.75,28 53.25,28.5 55.3,28.5 C12.2 | IC4.1 51.5,29.75 v51.75,30 | IC4.13 44.75,31 43.45,32.3 C10.2 | C11.2 39.25,28.25 39.75,27.75 39.75,27.25 40.25,26.75 IC4.19 | IC1.VDD 41.25,39 v43.5,36.75 | D1.P$2 83.25,41 83.25,22.25 82.5,21.5 75.75,21.5 75.7,21.45
  Top 0.406: Q5.2 75.7,21.45 73.75,19.5 55.75,19.5 55,18.75 v55,17.5 | v43.5,36.75 43.45,36.7 C13.2 C10.2
  Top 0.61: C9.2 40.45,17.5 v39,17.5 | C8.2 54.95,17.45 v55,17.5 | v55.5,29.75 55.5,28.3 C12.2 | 38.5,28.3 C11.2 | C14.2 C7.1+ 28.74,30.96 27.75,30.96 | C6.1+ 27.75,30.96 | L3.2 27.95,31.16 27.75,30.96
  Bottom 0.254: IC1.VDD 43.46,40.71 44.25,41.5 C39.2 45.8,42.3 47.48,43.98 OPH1.2
  Bottom 0.406: Q1.4 39.05,17.55 v39,17.5 38.55,17.95 R25.1 38.55,20.55 39.25,21.25 44.5,21.25 | v55,17.5 48.25,17.5 44.5,21.25 | 44.5,30 v38.5,30 v37,30 v35.5,30 | 44.5,30 44.5,35.75 v43.5,36.75 | 44.5,21.25 44.5,30 | 44.5,30 v51.75,30 52,29.75 v55.5,29.75
  pour Top (isolate 0.406): 13,23 13,25 17.75,25 17.75,24.5 29.25,24.5 29.25,30.5 39,30.5 39,23 28.75,23 28.75,0 26,0 26,23
VIN  (via drill 0.5, 0.7)
  Top 0.254: PWR.1 17.25,53.75 25,46 X1.1
  Top 0.61: SV3.1 37.53,45.78 36,44.25 28.95,44.25 | 28.75,45.85 X1.1 28.95,45.95 28.95,44.25 | 28.95,44.25 C38.1 30.79,38 IC10.3
  Bottom 0.406: IC8.1 19.3,25.55 v19.5,25.75 | IC6.1 17.55,39.95 v19.75,37.75
  pour Top (isolate 0.406): 18.5,25.25 24.75,25.25 24.75,37 29.75,37 29.75,47 28,47 28,41.75 18.5,41.75
VSS  (via drill 0.5, 0.7)
  Top 0.305: IC3.6 10.93,8.82 12,7.75 12,7.5 | 12,7.5 12,5.8 | IC7.6 10.82,13.07 | 10.82,13.07 11.95,14.2 C33.1 | IC7.1 12.12,11.78 10.82,13.07 | IC3.1 12.03,7.53 12,7.5
  Top 0.406: v13.5,21.5 v15,21.5 | 12,5.8 C31.1
  Bottom 0.406: v13.5,21.5 v15,21.5 16.75,21.5 | R12.2 19.75,20.25 19.3,20.7 IC8.5 19.25,21.5 16.75,21.5 | C22.1+ 16.75,21.5 | R9.1 11.75,3 12.75,2 v13.5,2
  pour Top (isolate 0.406): 19,6.5 19,0 0,0 0,22.25 19,22.25 19,14.75 6.5,14.75 6.5,6.5

### Text on the board
tNames: +5V | GND | PA0 | PC3 | PC2 | PC1 | PC0 | PC13 | PB9 | PB7 | PB6 | VBUS | x2 | x2 | STM32-Pi Board / Revision 1.3 / (C) Mikhail Kulesh | D- | D+ | x3 | +5V | micro-SD | SWD | NC | GND | NRST | VCC | CLK/ / IO | x5 | x4 | x4 | R | R | L | D+ | audio-DAC | D-class ampl | +3.3V | PA4 | PA5 | PA6 | PA7 | PC4 | PC5 | PB0 | PB1 | PB2 | PB10 | PB11 | PB12 | PB13 | PB14 | PB15 | PC6 | PC7 | PA8 | PA10 | L | A- | A+